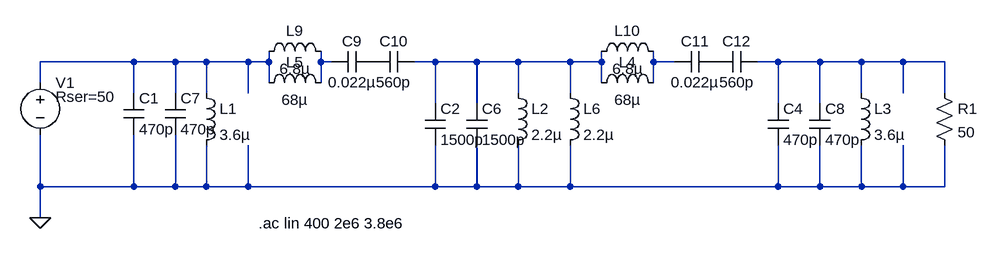
[diagram p0: schematic 3D3M.asc]
3D3M.asc, the LTspice schematic file:
Version 4
SHEET 1 1604 692
WIRE 304 192 160 192
WIRE 368 192 304 192
WIRE 416 192 368 192
WIRE 480 192 416 192
WIRE 512 192 512 176
WIRE 512 192 480 192
WIRE 592 192 592 176
WIRE 608 192 592 192
WIRE 768 192 736 192
WIRE 832 192 768 192
WIRE 896 192 832 192
WIRE 976 192 896 192
WIRE 1024 192 1024 176
WIRE 1024 192 976 192
WIRE 1104 192 1104 176
WIRE 1136 192 1104 192
WIRE 1296 192 1264 192
WIRE 1360 192 1296 192
WIRE 1424 192 1360 192
WIRE 1488 192 1424 192
WIRE 1552 192 1488 192
WIRE 160 224 160 192
WIRE 512 224 512 192
WIRE 592 224 592 192
WIRE 1024 224 1024 192
WIRE 1104 224 1104 192
WIRE 304 240 304 192
WIRE 368 240 368 192
WIRE 416 240 416 192
WIRE 480 240 480 192
WIRE 896 240 896 192
WIRE 976 240 976 192
WIRE 1424 240 1424 192
WIRE 1488 240 1488 192
WIRE 1552 240 1552 192
WIRE 768 256 768 192
WIRE 832 256 832 192
WIRE 1296 256 1296 192
WIRE 1360 256 1360 192
WIRE 160 384 160 304
WIRE 304 384 304 304
WIRE 304 384 160 384
WIRE 368 384 368 304
WIRE 368 384 304 384
WIRE 416 384 416 320
WIRE 416 384 368 384
WIRE 480 384 480 320
WIRE 480 384 416 384
WIRE 768 384 768 320
WIRE 768 384 480 384
WIRE 832 384 832 320
WIRE 832 384 768 384
WIRE 896 384 896 320
WIRE 896 384 832 384
WIRE 976 384 976 320
WIRE 976 384 896 384
WIRE 1296 384 1296 320
WIRE 1296 384 976 384
WIRE 1360 384 1360 320
WIRE 1360 384 1296 384
WIRE 1424 384 1424 320
WIRE 1424 384 1360 384
WIRE 1488 384 1488 320
WIRE 1488 384 1424 384
WIRE 1552 384 1552 320
WIRE 1552 384 1488 384
WIRE 160 432 160 384
FLAG 160 432 0
SYMBOL voltage 160 208 R0
WINDOW 39 24 38 Left 2
SYMATTR SpiceLine Rser=50
SYMATTR InstName V1
SYMATTR Value ""
SYMATTR Value2 AC 1
SYMBOL cap 288 240 R0
SYMATTR InstName C1
SYMATTR Value 470p
SYMBOL cap 752 256 R0
SYMATTR InstName C2
SYMATTR Value 1500p
SYMBOL ind 400 224 R0
SYMATTR InstName L1
SYMATTR Value 3.6µ
SYMBOL ind 880 224 R0
SYMATTR InstName L2
SYMATTR Value 2.2µ
SYMBOL ind 496 240 R270
WINDOW 0 32 56 VTop 2
WINDOW 3 5 56 VBottom 2
SYMATTR InstName L5
SYMATTR Value 68µ
SYMATTR SpiceLine Rser=45m
SYMBOL res 1536 224 R0
SYMATTR InstName R1
SYMATTR Value 50
SYMBOL cap 1280 256 R0
SYMATTR InstName C4
SYMATTR Value 470p
SYMBOL ind 1408 224 R0
SYMATTR InstName L3
SYMATTR Value 3.6µ
SYMBOL ind 1008 240 R270
WINDOW 0 32 56 VTop 2
WINDOW 3 5 56 VBottom 2
SYMATTR InstName L4
SYMATTR Value 68µ
SYMATTR SpiceLine Rser=45m
SYMBOL cap 816 256 R0
SYMATTR InstName C6
SYMATTR Value 1500p
SYMBOL cap 352 240 R0
SYMATTR InstName C7
SYMATTR Value 470p
SYMBOL cap 1344 256 R0
SYMATTR InstName C8
SYMATTR Value 470p
SYMBOL cap 672 176 R90
WINDOW 0 0 32 VBottom 2
WINDOW 3 32 32 VTop 2
SYMATTR InstName C9
SYMATTR Value 0.022µ
SYMBOL cap 736 176 R90
WINDOW 0 0 32 VBottom 2
WINDOW 3 32 32 VTop 2
SYMATTR InstName C10
SYMATTR Value 560p
SYMBOL cap 1200 176 R90
WINDOW 0 0 32 VBottom 2
WINDOW 3 32 32 VTop 2
SYMATTR InstName C11
SYMATTR Value 0.022µ
SYMBOL cap 1264 176 R90
WINDOW 0 0 32 VBottom 2
WINDOW 3 32 32 VTop 2
SYMATTR InstName C12
SYMATTR Value 560p
SYMBOL ind 960 224 R0
SYMATTR InstName L6
SYMATTR Value 2.2µ
SYMBOL ind 496 192 R270
WINDOW 0 32 56 VTop 2
WINDOW 3 5 56 VBottom 2
SYMATTR InstName L9
SYMATTR Value 6.8µ
SYMATTR SpiceLine Rser=0.62
SYMBOL ind 1008 192 R270
WINDOW 0 32 56 VTop 2
WINDOW 3 5 56 VBottom 2
SYMATTR InstName L10
SYMATTR Value 6.8µ
SYMATTR SpiceLine Rser=0.62
TEXT 496 440 Left 2 !.ac lin 400 2e6 3.8e6

The netlist it stands for:
* 3D3M.asc
V1 N001 0 AC 1 Rser=50
C1 N001 0 470p
C2 N003 0 1500p
L1 N001 0 3.6µ
L2 N003 0 2.2µ
L5 N001 N002 68µ Rser=45m
R1 N005 0 50
C4 N005 0 470p
L3 N005 0 3.6µ
L4 N003 N004 68µ Rser=45m
C6 N003 0 1500p
C7 N001 0 470p
C8 N005 0 470p
C9 P001 N002 0.022µ
C10 N003 P001 560p
C11 P002 N004 0.022µ
C12 N005 P002 560p
L6 N003 0 2.2µ
L9 N001 N002 6.8µ Rser=0.62
L10 N003 N004 6.8µ Rser=0.62
.ac lin 400 2e6 3.8e6
.backanno
.end